# Altium schematic sheet AnalogReceiverModule.SchDoc: CAN Current Loop Module - Analog Receiver
size A4; Author: Pablo R Nava; DrawnBy: Pablo R Nava; Engineer: Pablo R Nava
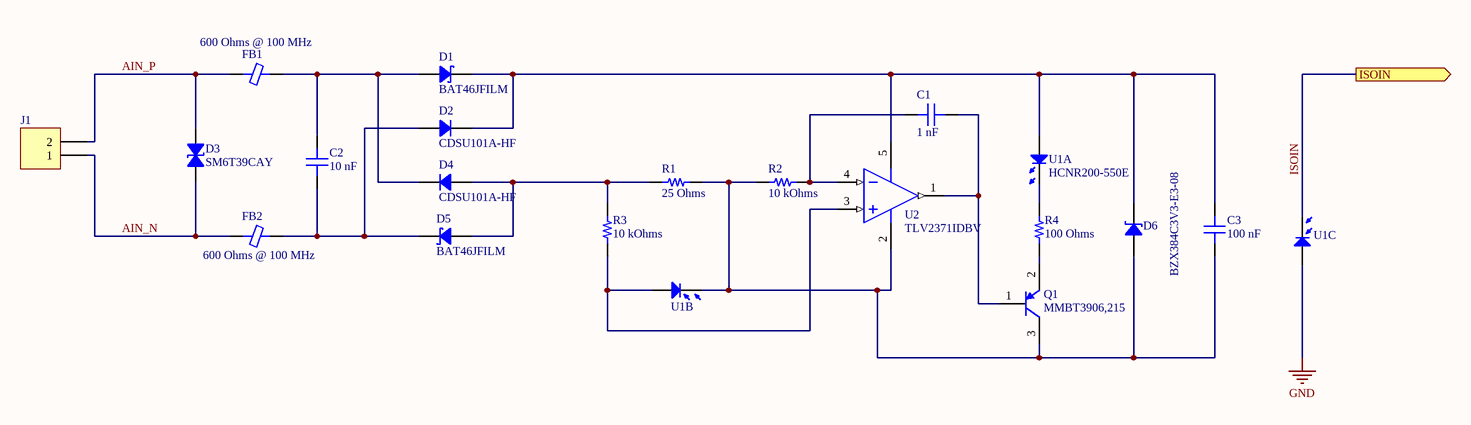
[diagram p0: AnalogReceiverModule.SchDoc]

## Parts
C1  1 nF  [CAP 0805_2012]
C2  10 nF  [CAP 0805_2012]
C3  100 nF  [CAP 0805_2012]
D1  BAT46JFILM  [SOD323]
D2  CDSU101A-HF  [SOD523F]
D3  SM6T39CAY  [DO214AA SMB]
D4  CDSU101A-HF  [SOD523F]
D5  BAT46JFILM  [SOD323]
D6  BZX384C3V3-E3-08  [SOD323]
FB1  600 Ohms @ 100 MHz  [FER 0805_2012]
FB2  600 Ohms @ 100 MHz  [FER 0805_2012]
J1  1757475  [MSTBA2]  (value not drawn)
Q1  MMBT3906,215  [NEXPERIA SOT-23-3]
R1  25 Ohms  [RES 0805_2012]
R2  10 kOhms  [RES 0805_2012]
R3  10 kOhms  [RES 0805_2012]
R4  100 Ohms  [RES 0805_2012]
U1  HCNR200-550E  [HCNR200]  (parts A,B,C of 3)
U2  TLV2371IDBV  [TI SOT-23-5 DBV]

## Ports
ISOIN (out)

## Nets
GND: U1.5(PD2_B)
AIN_N: D3.2 FB2.2 J1.1
AIN_P: D3.1 FB1.1 J1.2
ISOIN: U1.6(PD2_A) ; port ISOIN
NetC1_1: C1.1 Q1.1(B) U2.1(OUT)
NetC1_2: C1.2 R2.1 U2.4(IN-)
NetC2_1: C2.1 D2.1 D5.2 FB2.1
NetC2_2: C2.2 D1.1 D4.2 FB1.2
NetC3_1: C3.1 D6.1 Q1.3(C) R1.2 R2.2 U1.3(PD1_A) U2.2(GND)
NetC3_2: C3.2 D1.2 D2.2 D6.2 U1.2(LED_2) U2.5(VDD)
NetD4_1: D4.1 D5.1 R1.1 R3.1
NetQ1_2: Q1.2(E) R4.2
NetR3_2: R3.2 U1.4(PD1_B) U2.3(IN+)
NetR4_1: R4.1 U1.1(LED_1)

## Notes on the sheet
- Title:
- Drawn By:
- Page Contents:
- Checked By:
- Size:
- Date:
- File:
- License:
- Email:
- A4
- Number:
- Time:
- Revision:
- Sheet
- Website:
- of

## Library data of the parts
C1 = C0805C102J2GECAUTO: MLCC Ceramic 1 nF 200 V 5% Capacitor; Manufacturer: KEMET; Voltage: 200 V; Type: capacitor_ceramic; Through Hole: 0; Part Number: C0805C102J2GECAUTO; Value: 1 nF; Tolerance: 5%; Composition: NP0; Created On: 30/05/2020 9:42:16; Updated On: 30/05/2020 9:42:22; Package: 0805 (2012 Metric)
C2 = C0805C103K5GEC7210: MLCC Ceramic 10 nF 50 V 10% Capacitor; Manufacturer: KEMET; Voltage: 50 V; Type: capacitor_ceramic; Through Hole: 0; Part Number: C0805C103K5GEC7210; Value: 10 nF; Tolerance: 10%; Composition: NP0; Created On: 28/05/2020 20:55:06; Updated On: 28/05/2020 20:58:59; Package: 0805 (2012 Metric)
C3 = 08055C104K4Z2A: MLCC Ceramic 100 nF 50 V 10% Capacitor; Manufacturer: AVX; Voltage: 50 V; Type: capacitor_ceramic; Through Hole: 0; Part Number: 08055C104K4Z2A; Value: 100 nF; Tolerance: 10%; Composition: X7R; Created On: 30/05/2020 9:36:24; Updated On: 30/05/2020 9:36:39; Package: 0805 (2012 Metric)
D1 D5 = BAT46JFILM: Schottky Diode; Manufacturer: STMicroelectronics; Forward Voltage: 0.45 V; Reverse Leakage Current: 5 uA; Maximum Forward Avg. Current: 150 mA; Maximum Repetitive Reverse Voltage: 100 V; Type: diode_rectifier; Through Hole: 0; Part Number: BAT46JFILM; Diode Type: schottky; Created On: 16/05/2020 11:52:41; Updated On: 16/05/2020 14:59:23; Package: SOD-323
D2 D4 = CDSU101A-HF: General Purpose Diode; Manufacturer: Comchip Technology; Forward Voltage: 1 V; Reverse Leakage Current: 50 nA; Maximum Forward Avg. Current: 100 mA; Maximum Repetitive Reverse Voltage: 90 V; Diode Type: rectifier; Type: diode_rectifier; Through Hole: 0; Part Number: CDSU101A-HF; Created On: 16/05/2020 11:56:11; Updated On: 16/05/2020 15:37:54; Package: SOD-523F
D3 = SM6T39CAY: TVS Diode; Manufacturer: STMicroelectronics; Standoff Reverse Voltage: 33.3 V; Minimum Breakdown Voltage: 39 V; Maximum Clamping Voltage: 53.9 V; Type: diode_tvs; Through Hole: 0; Part Number: SM6T39CAY; Created On: 16/05/2020 11:52:32; Updated On: 16/05/2020 15:46:11; Package: DO-214AA-2
D6 = BZX384C3V3-E3-08: Zener Diode 3.3 V 200 mW; Manufacturer: Vishay; Tolerance: 5%; Maximum Power: 200 mW; Forward Voltage: 0.6 V; Zener Voltage: 3.3 nA; Type: diode_zener; Through Hole: 0; Part Number: BZX384C3V3-E3-08; Created On: 16/05/2020 22:26:20; Updated On: 16/05/2020 22:36:30; Package: SOD-323-2
FB1 FB2 = BLM21SP601SH1D: Ferrite bead; Manufacturer: Murata Electronics; Number of Lines: 1; DC Resistance: 60 mOhms; Current Rating: 1.5 A; Type: ferrite_bead; Through Hole: 0; Part Number: BLM21SP601SH1D; Value: 600 Ohms @ 100 MHz; Impedance Frequency: 600 Ohms @ 100 MHz; Created On: 16/05/2020 11:32:40; Updated On: 16/05/2020 17:15:58; Package: 0805 (2012 Metric)
J1 = 1757475: Pluggable Terminal Blocks 2 Pos 5mm pitch Through Hole Header; Manufacturer: Phoenix Contact; Voltage Rating: 250 V; Current Rating: 12 A; Number of Contacts: 2; Through Hole: 1; LatestRevisionDate: 17-Jul-2002; LatestRevisionNote: Re-released for DXP Platform.; Publisher: Altium Limited; Part Number: 1757475; Orientation: right; Pitch: 5 mm; Number of Rows: 1; Created On: 18/07/2020 15:45:14; Updated On: 18/07/2020 15:45:51; Type: connector_pcb; Package: Through Hole
Q1 = MMBT3906,215: PNP BJT Switching transistor; Manufacturer: Nexperia; Collector Emiter Saturation Voltage: 250 mW; hfe Gain: 300; Collector Emiter Max. Votage: 40 V; Collector Max. Current: 200 mA; Type: transistor_bjt; Through Hole: 0; Part Number: MMBT3906,215; Maximum Power: 250 mW; BJT Type: PNP; Created On: 17/05/2020 17:12:55; Updated On: 17/05/2020 18:19:58; Package: SOT-23
R1 = PAT0805E25R0BST1: Thin Film Resistor 25 Ohms 0.1%; Manufacturer: Vishay; Power Max: 200 mW; Through Hole: 0; Part Number: PAT0805E25R0BST1; Value: 25 Ohms; Tolerance: 0.1%; Created On: 16/05/2020 11:40:45; Updated On: 16/05/2020 13:13:11; Type: resistor; Package: 0805 (2012 Metric)
R2 R3 = CRCW080510K0FKEAC: Thin Film Resistor 10 kOhms 1%; Manufacturer: Vishay / Dale; Power Max: 125 mW; Through Hole: 0; Part Number: CRCW080510K0FKEAC; Value: 10 kOhms; Tolerance: 1%; Created On: 16/05/2020 11:50:43; Updated On: 16/05/2020 13:13:15; Type: resistor; Package: 0805 (2012 Metric)
R4 = CRCW0805100RFKEAC: Thin Film Resistor 100 Ohms 1%; Manufacturer: Vishay / Dale; Power Max: 125 mW; Through Hole: 0; Part Number: CRCW0805100RFKEAC; Value: 100 Ohms; Tolerance: 1%; Created On: 16/05/2020 11:51:25; Updated On: 16/05/2020 13:13:19; Type: resistor; Package: 0805 (2012 Metric)
U1 = HCNR200-550E: HCNR200 High-Linearity Analog Optocoupler; Manufacturer: Broadcom / Avago; Isolation Voltage: 1414 V; Transfer Gain: 1.00; Input FOrward Voltage: 1.6 V; Servo Gain: 0.5; Non Linearity: 0.01%; Through Hole: 0; Part Number: HCNR200-550E; Forward Gain: 0.5; Created On: 17/05/2020 9:43:12; Updated On: 17/05/2020 9:47:26; Type: optocoupler_linear; Package: DIP-8 Gull Wing
U2 = TLV2371IDBV: TLV2371 Rail-to-Rail I/O Opamp; Manufacturer: Texas Instruments; Gain Bandwith Product: 3 MHz; Amplifier Type: 125 mW; Slew Rate: 2.4 V/us; Voltage Supplies: 2.7-16 V; Input Offset Voltage: 2 mV; Output Current: 100 mA; Through Hole: 0; Part Number: TLV2371IDBV; Output Type: Rail-to-Rail; Input Type: Rail-to-Rail; Created On: 17/05/2020 15:21:19; Updated On: 17/05/2020 15:21:42; Type: opamp; Package: SOT-23-5